# Altium schematic sheet ifog-pcb-analogModule.SchDoc
size A3; SheetNumber: 1; SheetTotal: 1
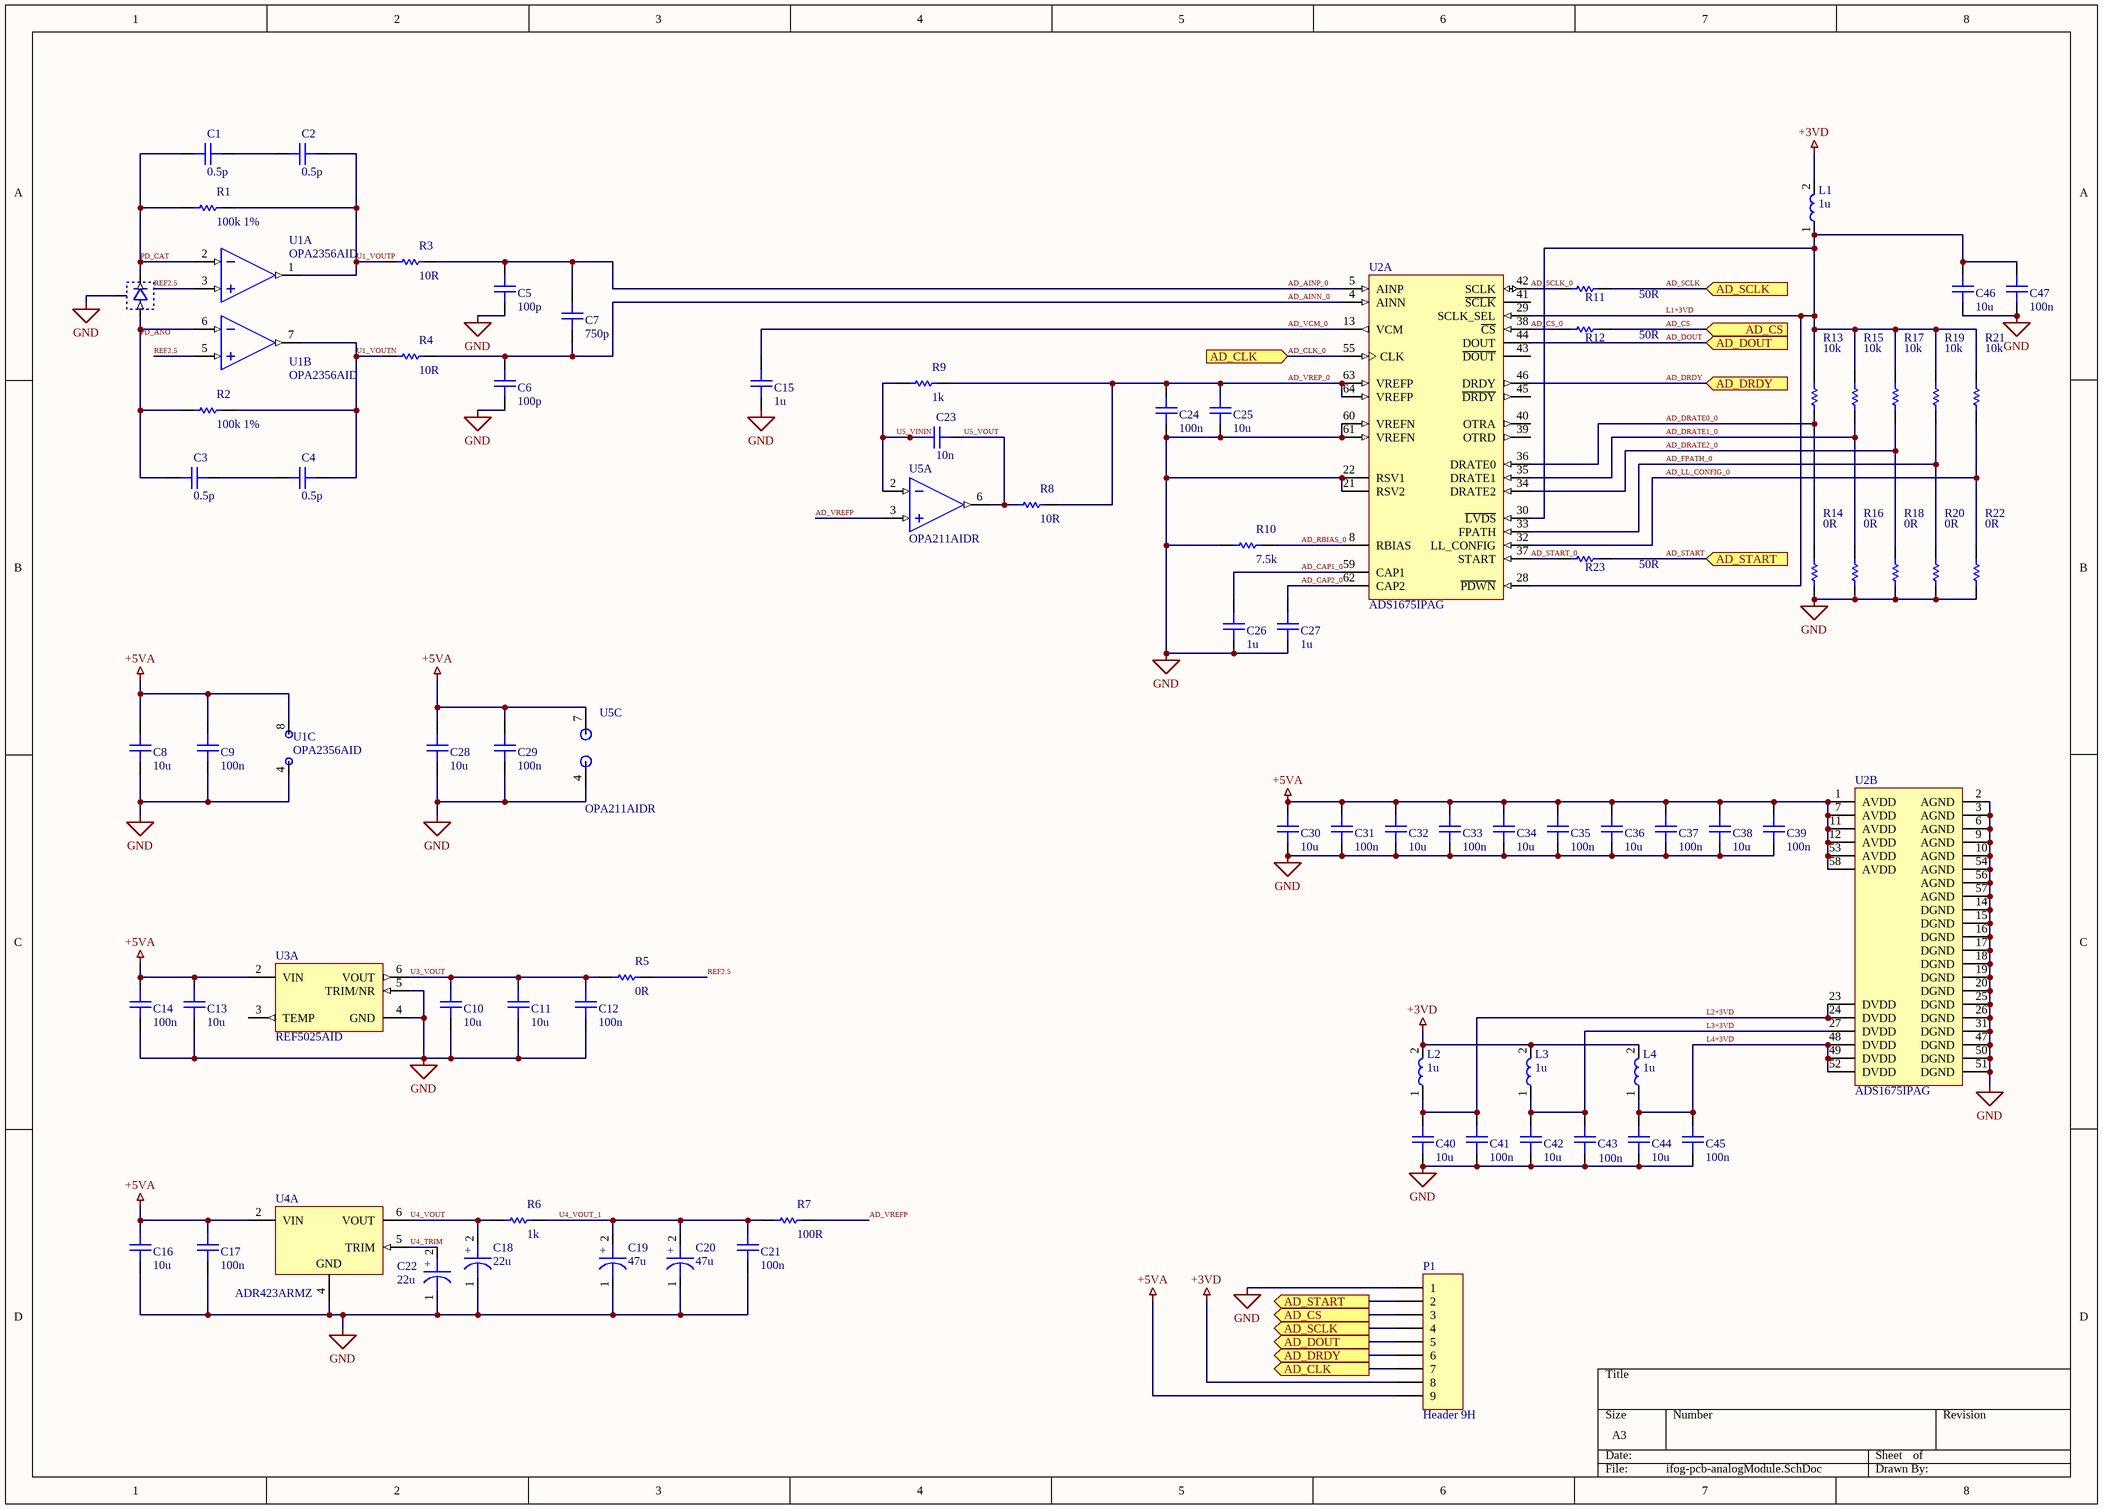
[diagram p0: ifog-pcb-analogModule.SchDoc]

## Parts
C1  0.5p  [CAPACITOR_0603]
C2  0.5p  [CAPACITOR_0603]
C3  0.5p  [CAPACITOR_0603]
C4  0.5p  [CAPACITOR_0603]
C5  100p  [CAPACITOR_0603]
C6  100p  [CAPACITOR_0603]
C7  750p  [CAPACITOR_0603]
C8  10u  [CAPACITOR_0603]
C9  100n  [CAPACITOR_0603]
C10  10u  [CAPACITOR_0603]
C11  10u  [CAPACITOR_0603]
C12  100n  [CAPACITOR_0603]
C13  10u  [CAPACITOR_0603]
C14  100n  [CAPACITOR_0603]
C15  1u  [CAPACITOR_0603]
C16  10u  [CAPACITOR_0603]
C17  100n  [CAPACITOR_0603]
C18  22u  [CAPACITOR_TANT_0603]
C19  47u  [CAPACITOR_TANT_0603]
C20  47u  [CAPACITOR_TANT_0603]
C21  100n  [CAPACITOR_0603]
C22  22u  [CAPACITOR_TANT_0603]
C23  10n  [CAPACITOR_0603]
C24  100n  [CAPACITOR_0603]
C25  10u  [CAPACITOR_0603]
C26  1u  [CAPACITOR_0603]
C27  1u  [CAPACITOR_0603]
C28  10u  [CAPACITOR_0603]
C29  100n  [CAPACITOR_0603]
C30  10u  [CAPACITOR_0603]
C31  100n  [CAPACITOR_0603]
C32  10u  [CAPACITOR_0603]
C33  100n  [CAPACITOR_0603]
C34  10u  [CAPACITOR_0603]
C35  100n  [CAPACITOR_0603]
C36  10u  [CAPACITOR_0603]
C37  100n  [CAPACITOR_0603]
C38  10u  [CAPACITOR_0603]
C39  100n  [CAPACITOR_0603]
C40  10u  [CAPACITOR_0603]
C41  100n  [CAPACITOR_0603]
C42  10u  [CAPACITOR_0603]
C43  100n  [CAPACITOR_0603]
C44  10u  [CAPACITOR_0603]
C45  100n  [CAPACITOR_0603]
C46  10u  [CAPACITOR_0603]
C47  100n  [CAPACITOR_0603]
L1  1u  [INDUCTOR_0603]
L2  1u  [INDUCTOR_0603]
L3  1u  [INDUCTOR_0603]
L4  1u  [INDUCTOR_0603]
P1  Header 9H  [HDR1X9H]
PD1  PDS123-CSA-C0102  [Photodetector]  (value not drawn)
R1  100k 1%  [RESISTOR_0603]
R2  100k 1%  [RESISTOR_0603]
R3  10R  [RESISTOR_0603]
R4  10R  [RESISTOR_0603]
R5  0R  [RESISTOR_0603]
R6  1k  [RESISTOR_0603]
R7  100R  [RESISTOR_0603]
R8  10R  [RESISTOR_0603]
R9  1k  [RESISTOR_0603]
R10  7.5k  [RESISTOR_0603]
R11  50R  [RESISTOR_0603]
R12  50R  [RESISTOR_0603]
R13  10k  [RESISTOR_0603]
R14  0R  [RESISTOR_0603]
R15  10k  [RESISTOR_0603]
R16  0R  [RESISTOR_0603]
R17  10k  [RESISTOR_0603]
R18  0R  [RESISTOR_0603]
R19  10k  [RESISTOR_0603]
R20  0R  [RESISTOR_0603]
R21  10k  [RESISTOR_0603]
R22  0R  [RESISTOR_0603]
R23  50R  [RESISTOR_0603]
U1  OPA2356AID  [OPA2356_SOIC8]  (parts A,B,C of 3)
U2  ADS1675IPAG  [TI-PAG64_L]  (parts A,B of 2)
U3  REF5025AID  [OPA2356_SOIC8]  (part A of 2)
U4  ADR423ARMZ  [ADR423_SOP8]  (part A of 2)
U5  OPA211AIDR  [OPA211_SOIC8]  (parts A,C of 3)

## Ports
AD_CLK (in), AD_CLK (out), AD_CS (in), AD_CS (out), AD_DOUT (in), AD_DOUT (out), AD_DRDY (in), AD_DRDY (out), AD_SCLK (in), AD_SCLK (out), AD_START (in), AD_START (out)

## Nets
+3VD: L1.2 L2.2 L3.2 L4.2 P1.8
+5VA: C8.2 C9.2 C13.2 C14.2 C16.2 C17.2 C28.2 C29.2 C30.2 C31.2 C32.2 C33.2 C34.2 C35.2 C36.2 C37.2 C38.2 C39.2 P1.9 U1.8(V+) U2.1(AVDD) U2.7(AVDD) U2.11(AVDD) U2.12(AVDD) U2.53(AVDD) U2.58(AVDD) U3.2(VIN) U4.2(VIN) U5.7(V+)
GND: C5.1 C6.1 C8.1 C9.1 C10.1 C11.1 C12.1 C13.1 C14.1 C15.1 C16.1 C17.1 C18.1(C) C19.1(C) C20.1(C) C21.1 C22.1(C) C24.1 C25.1 C26.1 C27.1 C28.1 C29.1 C30.1 C31.1 C32.1 C33.1 C34.1 C35.1 C36.1 C37.1 C38.1 C39.1 C40.1 C41.1 C42.1 C43.1 C44.1 C45.1 C46.1 C47.1 P1.1 PD1.GND R10.1 R14.1 R16.1 R18.1 R20.1 R22.1 U1.4(V-) U2.2(AGND) U2.3(AGND) U2.6(AGND) U2.9(AGND) U2.10(AGND) U2.14(DGND) U2.15(DGND) U2.16(DGND) U2.17(DGND) U2.18(DGND) U2.19(DGND) U2.20(DGND) U2.21(RSV2) U2.22(RSV1) U2.25(DGND) U2.26(DGND) U2.31(DGND) U2.47(DGND) U2.50(DGND) U2.51(DGND) U2.54(AGND) U2.56(AGND) U2.57(AGND) U2.60(VREFN) U2.61(VREFN) U3.4(GND) U3.5(TRIM/NR) U4.4(GND) U5.4(V-)
AD_AINN_0: C6.2 C7.1 R4.2 U2.4(AINN)
AD_AINP_0: C5.2 C7.2 R3.2 U2.5(AINP)
AD_CAP1_0: C26.2 U2.59(CAP1)
AD_CAP2_0: C27.2 U2.62(CAP2)
AD_CLK_0: P1.7 U2.55(CLK) ; port AD_CLK
AD_CS: P1.3 R12.2 ; port AD_CS
AD_CS_0: R12.1 U2.38(~{CS})
AD_DOUT: P1.5 U2.44(DOUT) ; port AD_DOUT
AD_DRATE0_0: R13.1 R14.2 U2.36(DRATE0)
AD_DRATE1_0: R15.1 R16.2 U2.35(DRATE1)
AD_DRATE2_0: R17.1 R18.2 U2.34(DRATE2)
AD_DRDY: P1.6 U2.46(DRDY) ; port AD_DRDY
AD_FPATH_0: R19.1 R20.2 U2.33(FPATH)
AD_LL_CONFIG_0: R21.1 R22.2 U2.32(LL_CONFIG)
AD_RBIAS_0: R10.2 U2.8(RBIAS)
AD_SCLK: P1.4 R11.2 ; port AD_SCLK
AD_SCLK_0: R11.1 U2.42(SCLK)
AD_START: P1.2 R23.2 ; port AD_START
AD_START_0: R23.1 U2.37(START)
AD_VCM_0: C15.2 U2.13(VCM)
AD_VREFP: R7.2 U5.3(IN+)
AD_VREP_0: C24.2 C25.2 R8.2 R9.2 U2.63(VREFP) U2.64(VREFP)
L1+3VD: C46.2 C47.2 L1.1 R13.2 R15.2 R17.2 R19.2 R21.2 U2.28(~{PDWN}) U2.29(SCLK_SEL) U2.30(~{LVDS})
L2+3VD: C40.2 C41.2 L2.1 U2.23(DVDD) U2.24(DVDD)
L3+3VD: C42.2 C43.2 L3.1 U2.27(DVDD)
L4+3VD: C44.2 C45.2 L4.1 U2.48(DVDD) U2.49(DVDD) U2.52(DVDD)
PD_ANO: C3.2 PD1.P R2.1 U1.6(IN_B-)
PD_CAT: C1.2 PD1.N R1.1 U1.2(IN_A-)
REF2.5: R5.2 U1.3(IN_A+) U1.5(IN_B+)
U1_VOUTN: C4.1 R2.2 R4.1 U1.7(OUT_B)
U1_VOUTP: C2.1 R1.2 R3.1 U1.1(OUT_A)
U3_VOUT: C10.2 C11.2 C12.2 R5.1 U3.6(VOUT)
U4_TRIM: C22.2(A) U4.5(TRIM)
U4_VOUT: C18.2(A) R6.1 U4.6(VOUT)
U4_VOUT_1: C19.2(A) C20.2(A) C21.2 R6.2 R7.1
U5_VININ: C23.2 R9.1 U5.2(IN-)
U5_VOUT: C23.1 R8.1 U5.6(OUT)
NetC1_1: C1.1 C2.2
NetC3_1: C3.1 C4.2

Not connected (* = marked no-connect by the designer): U2 39(OTRD) 40(OTRA) 41(~{SCLK}) 43(~{DOUT}) 45(~{DRDY}); U3 3(TEMP)

## Notes on the sheet
- (in symbol CAPACITOR_TANT_0603) +

## Library data of the parts
C1-C17 C21 C23-C47 = CAPACITOR_0603: Part Number: C0603C105K3RACTU; Manufacturer: KEMET; Manufacturer Part Number: C0603C105K3RACTU
C18-C20 C22 = CAPACITOR_TANT_0603: CAP TANT 0603; Manufacturer: Kyocera AVX; Manufacturer Part Number: F981A226MMALZT; Tolerance: 20%; Material: Tantalum; Dissipation Factor: 30%; Voltage Rating: 10V; Ripple Current: 56mA; Esr: 8Ω; Life: 1000Hours; Capacitance: 22uF; Value: 22uF; Leakage Current: 11uA; Temperature: -55°C to +125°C; RoHS: TRUE; Category: Cap; Temperature Range High: +125°C; Device Class L1: Passive Components; Mouser Description: Tantalum Capacitors - Solid SMD 22uF 10V 20% 0603,1.6x0.85x0.65mm; Temperature Range Low: -55°C; Device Class L2: Capacitors; Footprint Url: http://www.avx.com/download/software/literature/AVX-Footprint-Library.pdf; Device Class L3: Tantalum Capacitors; Package: F98M; Temperature Coefficient: 30%; Height: 0.9mm; Octopart: https://octopart.com/f981a226mmalzt-avx-33960279; Automotive: No; ComponentLink2Description: Datasheet; Digikey Description: CAP TANT 22UF 20% 10V 0603; ComponentLink2URL: http://datasheets.avx.com/F98.pdf; Lead Free: Yes
L1-L4 = INDUCTOR_0603: FIXED IND SMD; Manufacturer: Murata; Manufacturer Part Number: LQM18FN1R0M00D; Inductance Tolerance: 20%; Current Rating: 150mA; Shielding: Shielded; Self Resonant Frequency: 120MHz; DC Resistance (DCR): 200mR; Inductance: 1uH; Core Material: Ferrite; Test Frequency: 1MHz; Max DC Current: 150mA; Min Operating Temperature: -55°C; Case Code (Metric): 1608; Length: 0.063inch; Height - Seated (Max): 0.035inch; Case/Package: 0603; Depth: 0.9mm; Series: LQM18F; Rated Current-Max: 150mA; REACH SVHC: No SVHC; Mount: Surface Mount; Military Standard: Not; Max Operating Temperature: 125°C; Lead Free: Lead Free; Width: 0.031inch; Tolerance: 20%; Radiation Hardening: No; Saturation Current: 150mA; DC Current: 150mA; RoHS Compliant: Yes; Height: 0.9mm; Packaging: Tape and Reel; Termination: SMD/SMT; Package Quantity: 1; Case Code (Imperial): 0603
P1 = Header 9H: Header, 9-Pin, Right Angle; LatestRevisionDate: 17-Jul-2002; LatestRevisionNote: Re-released for DXP Platform.; Publisher: Altium Limited
PD1 = PDS123-CSA-C0102: Photodiode 3 pins; Text Field1: 10; Text Field2: 20
R1-R23 = RESISTOR_0603: Chip Resistor 0603 (1608 Metric), RoHS, Tape and Reel; Manufacturer: Vishay; Manufacturer Part Number: CRCW060310K0FKEA; Voltage Rating: 75 V; Height: 0.45 mm; Length: 1.55 mm; Package Quantity: 5000; Packaging: Tape and Reel; Max Operating Temperature: 155 degC; Min Operating Temperature: -55 degC; PackageDescription: 2-Pin Surface Mount Device, Body 1.575 x 0.85 mm; ComponentLink1Description: Manufacturer URL; RoHSCompliant: true; PackageReference: 0603; REACH SVHC: Unknown; DatasheetVersion: 06/2012; Mounting Technology: Surface Mount; ComponentLink2URL: https://datasheet.ciiva.com/11809/0900766b80d98afc-11809037.pdf; ComponentLink2Description: Datasheet; ComponentLink1URL: http://www.vishay.com/
U1 = OPA2356AID: 200 MHz GBW, CMOS Dual Operational Amplifier, 2.5 to 5.5 V, -40 to 125 degC, 8-pin SOIC (D8), Green (RoHS & no Sb/Br); Manufacturer: Texas Instruments; Sub Family: High Output Current Amplifier (>=50mA), High Speed Amplifier (>=50MHz), Low Supply Voltage Amplifier (<=2.7V); @ MHz: 1; 3rd Harmonic(dBc): 93; BW @ Acl(MHz): 450; Vs(Max)(V): 5.5; Vn at Flatband(Typ)(nV/rtHz): 5.8; Vs(Min)(V): 2.5; Diff Phase(deg): 0.05; Io(Typ)(mA): 100; THD (Fc is 1 MHz)(Typ)(dB): -79; Rail-Rail: Out; Settling Time (0.1%)(Typ)(ns): 30; Slew Rate(Typ)(V/us): 360; 2nd Harmonic(dBc): 81; Diff Gain(%): 0.02; Iq per channel(Max)(mA): 14; Vio(Max)(mV): 9; Number of Channels: 2; Acl, min stable gain(V/V): 1; ComponentLink1URL: http://www.ti.com/; PackageReference: D0008A; ComponentLink2URL: http://www.ti.com/general/docs/lit/getliterature.tsp?genericPartNumber=OPA2356&fileType=pdf; Code_JEDEC: MS-012; Eco-Plan: Green (RoHS & no Sb/Br); PackageVersion: 4040047-3/M, 06/2011; DatasheetVersion: SBOS212A; PackageDescription: 8-Pin Plastic Small Outline, Body 4.9 x 3.9 mm, Pitch 1.27 mm; ComponentLink2Description: Datasheet; Iib(Max)(nA): 0.05; PartNumber: OPA2356AID; ComponentLink1Description: Manufacturer URL; ComponentLink3URL: http://www.ti.com/litv/pdf/msoi002j; Mounting Technology: Surface Mount; ComponentLink3Description: Package Specification; Manufacturer Part Number: OPA2356AID
U2 = ADS1675: 4 MSPS, 24-Bit ADC, -40 to 85 degC, 64-pin QFP (PAG64), Green (RoHS & no Sb/Br); Manufacturer: Texas Instruments; Analog Voltage AV/DD(Min)(V): 4.75; Analog Voltage AV/DD(Max)(V): 5.25; SFDR(dB): 120; Resolution(Bits): 24; # Input Channels: 1; SubFamily: Precision ADC (<=10MSPS); Architecture: Delta-Sigma; SNR(dB): 92; Digital Supply(Min)(V): 2.85; Sample Rate (max)(SPS): 4M; Digital Supply(Max)(V): 3.15; Interface: Parallel LVDS, Serial SPI; Eco-Plan: Green (RoHS & no Sb/Br); ComponentLink3URL: http://www.ti.com/lit/ml/mtqf006a/mtqf006a.pdf; PackageDescription: 64-Pin Plastic Flat Pack, Body 10 x 10 mm, Pitch 0.50 mm; PackageVersion: 4040282/C, 11/1996; Mounting Technology: Surface Mount; ComponentLink1URL: http://www.ti.com/; ComponentLink2URL: http://www.ti.com/general/docs/lit/getliterature.tsp?genericPartNumber=ADS1675&fileType=pdf; PartNumber: ADS1675IPAG; ComponentLink2Description: Datasheet; ComponentLink3Description: Package Specification; PackageReference: PAG64; ComponentLink1Description: Manufacturer URL; Code_JEDEC: MS-026; DatasheetVersion: SBAS416D; Manufacturer Part Number: ADS1675IPAG
U3 = REF5025AID: Low Noise, Very Low Drift, Precision Voltage Reference, -40 to 125 degC, 8-pin SOIC (D), Green (RoHS & no Sb/Br); Manufacturer: Texas Instruments; Iq(Max)(uA): 1000; Initial Accuracy @ 25/deg C(%): 0.05; Rating: Military; VO(V): 2.5; VI(Max)(V): 18; SubFamily: Series Voltage Reference; Iout/Iz(Max)(mA): 10; VI(Min)(V): 2.7; Temp Coeff(Max)(ppm/ degree C): 3; PartNumber: REF5025AID; DatasheetVersion: SBOS410E; PackageVersion: 4040047-3/M; Mounting Technology: Surface Mount; PackageDescription: 8-Pin Plastic Small Outline, Body 4.9 x 3.9 mm, Pitch 1.27 mm; ComponentLink1URL: http://www.ti.com/; Code_JEDEC: MS-012; ComponentLink4Description: URL Link1; ComponentLink1Description: Manufacturer URL; ComponentLink3Description: Package Specification; Eco-Plan: Green (RoHS & no Sb/Br); ComponentLink4URL: Samples URL:http://www.ti.com/product/ref5025; PackageReference: D0008A; ComponentLink3URL: http://www.ti.com/litv/pdf/msoi002j; ComponentLink2Description: Datasheet; ComponentLink2URL: http://www.ti.com/general/docs/lit/getliterature.tsp?genericPartNumber=REF5025&fileType=pdf; Manufacturer Part Number: REF5025AID
U4 = ADR423ARMZ: Ultraprecision, Low Noise, XFET(R) Voltage Reference, 3 V Output, 5 to 18 V Supply, Industrial, 8-pin SOP (RM-8), Tube; Manufacturer: Analog Devices; Min V Supply (V): 5; Vout: 3V; Max V Supply (V): 18; Ref Out TC (ppm/C): 2; PartNumber: ADR423ARMZ; ComponentLink2Description: Datasheet; Operating Temp Range: -40 to 125 degC; Mounting Technology: Surface Mount; ComponentLink2URL: http://www.analog.com/static/imported-files/data_sheets/ADR420_421_423_425.pdf; ComponentLink1Description: Manufacturer URL; Packing: Tube; PackageReference: RM-8; PackageDescription: 8-Pin Mini Small Outline Package, Body 3 x 3 mm, Pitch 0.65 mm; ComponentLink4Description: URL Link1; ComponentLink4URL: Product URL:http://www.analog.com/en/special-linear-functions/voltage-references/adr423/products/product.html; ComponentLink1URL: http://www.analog.com/en/index.html; ComponentLink3Description: Package Specification; PackageVersion: Aug-05; ComponentLink3URL: http://www.analog.com/static/imported-files/packages/PKG_PDF/MSOP%28RM%29/RM_8.pdf; DatasheetVersion: Rev. I; Code_JEDEC: MO-187-AA; Manufacturer Part Number: ADR423ARMZ
U5 = OPA211AIDR: 1.1 nV/rtHz Noise, Low Power, Precision Operational Amplifier, 4.5 to 36 V, -40 to 125 degC, 8-pin SOIC (D8), Green (RoHS & no Sb/Br); Manufacturer: Texas Instruments; Number of Channels: 1; IIB(Max)(pA): 175000; Vio (25C)(Max)(mV): 0.125; Rating: Catalog; CMRR(Min)(dB): 114; Total Supply Voltage(Min)(+5V is 5, +/-5V is 10): 4.5; Slew Rate(Typ)(V/us): 27; Sub Family: High Supply Voltage Amplifier (>=30V), Low Noise Amp (<=10nV/rtHz), Low Offset Voltage Amplifier (<=500uV), Precision Amplifier; Total Supply Voltage(Max)(+5V is 5, +/-5V is 10): 36; Offset Drift(Typ)(uV/C): 0.15; Packing: LARGE T&R; GBW(Typ)(MHz): 45; PackageVersion: 4040047-3/M, 06/2011; ComponentLink3URL: http://www.ti.com/litv/pdf/msoi002j; ComponentLink1URL: http://www.ti.com/; PackageDescription: 8-Pin Plastic Small Outline, Body 4.9 x 3.9 mm, Pitch 1.27 mm; Code_JEDEC: MS-012; DatasheetVersion: SBOS377G; ComponentLink2URL: http://www.ti.com/lit/ds/symlink/opa211.pdf; PartNumber: OPA211AIDR; Iq per channel(Max)(mA): 4.5; Mounting Technology: Surface Mount; ComponentLink3Description: Package Specification; ComponentLink1Description: Manufacturer URL; Eco-Plan: Green (RoHS & no Sb/Br); PackageReference: D0008A; ComponentLink2Description: Datasheet; Manufacturer Part Number: OPA211AIDR